# Altium schematic sheet Laser Driver_v6.1.SchDoc
size Tabloid
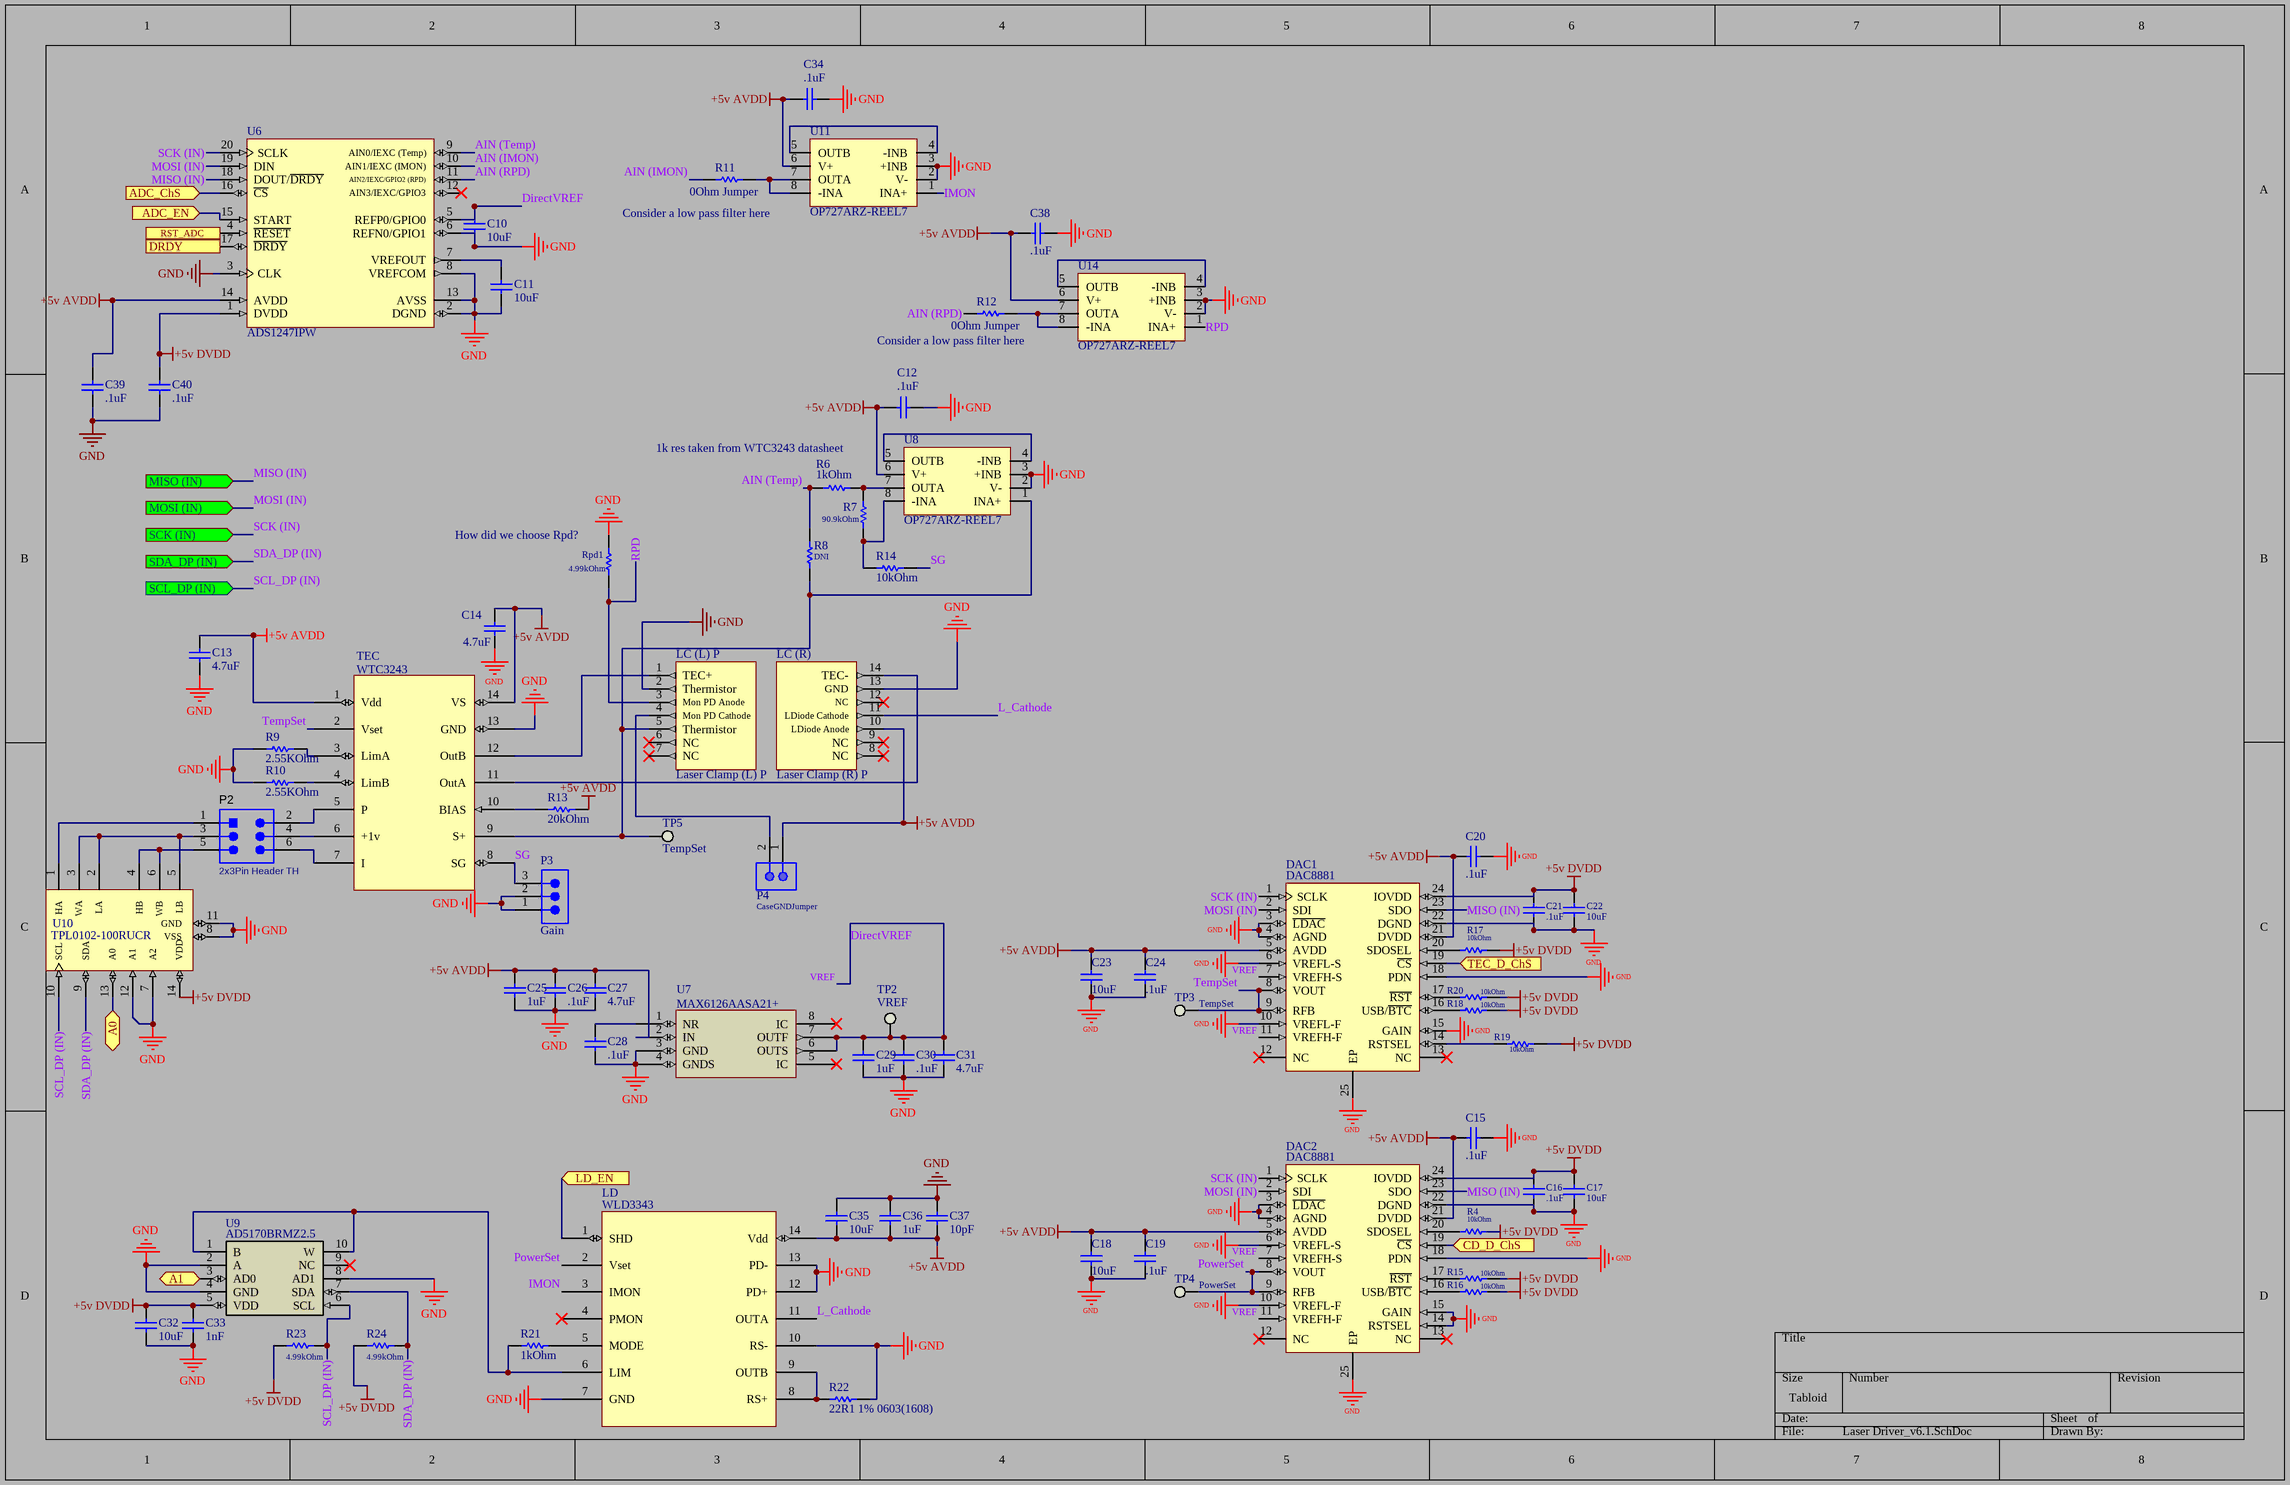
[diagram p0: Laser Driver_v6.1.SchDoc]

## Parts
C10  10uF  [CAPC1608X90X35ML10T15]
C11  10uF  [CAPC1608X90X35ML10T15]
C12  .1uF  [CAPC1608X90X35ML15T15]
C13  4.7uF  [CAPC1608X90X35ML10T15]
C14  4.7uF  [CAPC1608X90X35ML10T15]
C15  .1uF  [CAPC1608X90X35ML15T15]
C16  .1uF  [CAPC1608X90X35ML15T15]
C17  10uF  [CAPC1608X90X35ML10T15]
C18  10uF  [CAPC1608X90X35ML10T15]
C19  .1uF  [CAPC1608X90X35ML15T15]
C20  .1uF  [CAPC1608X90X35ML15T15]
C21  .1uF  [CAPC1608X90X35ML15T15]
C22  10uF  [CAPC1608X90X35ML10T15]
C23  10uF  [CAPC1608X90X35ML10T15]
C24  .1uF  [CAPC1608X90X35ML15T15]
C25  1uF  [CAPC1608X90X35ML15T15]
C26  .1uF  [CAPC1608X90X35ML15T15]
C27  4.7uF  [CAPC1608X90X35ML10T15]
C28  .1uF  [CAPC1608X90X35ML15T15]
C29  1uF  [CAPC1608X90X35ML15T15]
C30  .1uF  [CAPC1608X90X35ML15T15]
C31  4.7uF  [CAPC1608X90X35ML10T15]
C32  10uF  [CAPC1608X90X35ML10T15]
C33  1nF  [CAPC1608X90X35LL15T15]
C34  .1uF  [CAPC1608X90X35ML15T15]
C35  10uF  [CAPC1608X90X35ML10T15]
C36  1uF  [CAPC1608X90X35ML15T15]
C37  10pF  [CAPC1608X90X35LL15T15]
C38  .1uF  [CAPC1608X90X35ML15T15]
C39  .1uF  [CAPC1608X90X35ML15T15]
C40  .1uF  [CAPC1608X90X35ML15T15]
DAC1  DAC8881  [TI-RGE24-2450X2450TP_V]
DAC2  DAC8881  [TI-RGE24-2450X2450TP_V]
LC_(L)_P  Laser Clamp (L) P  [LaserClamp_L_Pump]
LC_(R)  Laser Clamp (R) P  [LaserClamp_R_Pump]
LD  WLD3343  [WLD3343]
P2  2x3Pin Header TH  [SMTC-TSW-103-07-G-D_V]
P3  Gain  [SMTC-TSW-103-07-X-S]
P4  CaseGNDJumper  [SMTC-TSW-102-07-S-S]
R4  10kOhm  [RESC1609X55X30LL15T15]
R6  1kOhm  [RESC1609X50X30LL8T20]
R7  90.9kOhm  [RESC1608X55X30NL15T15]
R8  DNI  [RESC1608X55X25NL10T15]
R9  2.55KOhm  [RESC1608X55X25NL10T15]
R10  2.55KOhm  [RESC1608X55X25NL10T15]
R11  0Ohm Jumper  [RESC1608X55X25NL10T15]
R12  0Ohm Jumper  [RESC1608X55X25NL10T15]
R13  20kOhm  [RESC1608X55X25NL10T15]
R14  10kOhm  [RESC1609X55X30LL15T15]
R15  10kOhm  [RESC1609X55X30LL15T15]
R16  10kOhm  [RESC1609X55X30LL15T15]
R17  10kOhm  [RESC1609X55X30LL15T15]
R18  10kOhm  [RESC1609X55X30LL15T15]
R19  10kOhm  [RESC1609X55X30LL15T15]
R20  10kOhm  [RESC1609X55X30LL15T15]
R21  1kOhm  [RESC1609X50X30LL8T20]
R22  22R1 1% 0603(1608)  [RESC0603(1608)_M]
R23  4.99kOhm  [RESC1608X55X30NL15T15]
R24  4.99kOhm  [RESC1608X55X30NL15T15]
Rpd1  4.99kOhm  [RESC1608X55X30NL15T15]
TEC  WTC3243  [WTC3243]
TP2  VREF  [KSTN-5015_V]
TP3  TempSet  [KSTN-5015_V]
TP4  PowerSet  [KSTN-5015_V]
TP5  TempSet  [KSTN-5015_V]
U6  ADS1247IPW  [TI-PW20_N]
U7  MAX6126AASA21+  [21-0041B_8]
U8  OP727ARZ-REEL7  [ADI-R-8_L]
U9  AD5170BRMZ2.5  [RM_10]
U10  TPL0102-100RUCR  [TI-RUC14_V]
U11  OP727ARZ-REEL7  [ADI-R-8_L]
U14  OP727ARZ-REEL7  [ADI-R-8_L]

## Ports
A0 (bidir), A1 (bidir), ADC_ChS (in), ADC_EN (in), CD_D_ChS (in), DRDY (in), LD_EN (in), MISO (IN) (in), MOSI (IN) (in), RST_ADC (in), SCK (IN) (in), SCL_DP (IN) (in), SDA_DP (IN) (in), TEC_D_ChS (in)

## Nets
+5v AVDD: C12.1 C13.2 C14.2 C15.1 C18.1 C19.1 C20.1 C23.1 C24.1 C25.2 C26.2 C27.2 C34.1 C35.1 C36.2 C37.1 C38.1 C39.2 DAC1.5(AVDD) DAC1.21(DVDD) DAC2.5(AVDD) DAC2.21(DVDD) LC_(R).10(LDiode_Anode) LD.14(Vdd) P4.1 R13.2 TEC.1(Vdd) TEC.14(VS) U6.14(AVDD) U7.2(IN) U8.6(V+) U11.6(V+) U14.6(V+)
+5v DVDD: C16.2 C17.2 C21.2 C22.2 C32.2 C33.2 C40.2 DAC1.24(IOVDD) DAC2.24(IOVDD) R4.2 R15.2 R16.2 R17.2 R18.2 R19.2 R20.2 R23.1 R24.1 U6.1(DVDD) U9.5(VDD) U10.14(VDD)
GND: C10.1 C11.1 C12.2 C13.1 C14.1 C15.2 C16.1 C17.1 C18.2 C19.2 C20.2 C21.1 C22.1 C23.2 C24.2 C25.1 C26.1 C27.1 C28.1 C29.1 C30.1 C31.1 C32.1 C33.1 C34.2 C35.2 C36.1 C37.2 C38.2 C39.1 C40.1 DAC1.3(~{LDAC}) DAC1.4(AGND) DAC1.6(VREFL-S) DAC1.10(VREFL-F) DAC1.15(GAIN) DAC1.18(PDN) DAC1.22(DGND) DAC1.25(EP) DAC2.3(~{LDAC}) DAC2.4(AGND) DAC2.6(VREFL-S) DAC2.10(VREFL-F) DAC2.14(RSTSEL) DAC2.15(GAIN) DAC2.18(PDN) DAC2.22(DGND) DAC2.25(EP) LC_(L)_P.2(Thermistor) LC_(R).13(GND) LD.7(GND) LD.10(RS-) LD.12(PD+) LD.13(PD-) P3.1 P3.2 R9.1 R10.1 R22.2 Rpd1.2 TEC.13(GND) U6.2(DGND) U6.3(CLK) U6.6(REFN0/GPIO1) U6.8(VREFCOM) U6.13(AVSS) U7.3(GND) U7.4(GNDS) U8.2(V-) U8.3(+INB) U9.2(A) U9.4(GND) U9.8(AD1) U10.7(A2) U10.8(VSS) U10.11(GND) U10.12(A1) U11.2(V-) U11.3(+INB) U14.2(V-) U14.3(+INB)
A0: U10.13(A0) ; port A0
A1: U9.3(AD0) ; port A1
ADC_ChS: U6.16(~{CS}) ; port ADC_ChS
ADC_EN: U6.15(START) ; port ADC_EN
AIN (IMON): R11.1 U6.10(AIN1/IEXC_(IMON))
AIN (RPD): R12.1 U6.11(AIN2/IEXC/GPIO2_(RPD))
AIN (Temp): R6.1 R8.2 U6.9(AIN0/IEXC_(Temp))
CD_D_ChS: DAC2.19(~{CS}) ; port CD_D_ChS
DirectVREF: C10.2 C29.2 C30.2 C31.2 DAC1.7(VREFH-S) DAC1.11(VREFH-F) DAC2.7(VREFH-S) DAC2.11(VREFH-F) TP2.1 U6.5(REFP0/GPIO0) U7.6(OUTS) U7.7(OUTF)  [also labelled VREF]
DRDY: U6.17(~{DRDY}) ; port DRDY
IMON: LD.3(IMON) U11.1(INA+)
L_Cathode: LC_(R).11(LDiode_Cathode) LD.11(OUTA)
LD_EN: LD.1(SHD) ; port LD_EN
MISO (IN): DAC1.23(SDO) DAC2.23(SDO) U6.18(DOUT/~{DRDY}) ; port MISO (IN)
MOSI (IN): DAC1.2(SDI) DAC2.2(SDI) U6.19(DIN) ; port MOSI (IN)
PowerSet: DAC2.8(VOUT) DAC2.9(RFB) LD.2(Vset) TP4.1
RPD: LC_(L)_P.3(Mon_PD_Anode) Rpd1.1 U14.1(INA+)
RST_ADC: U6.4(~{RESET}) ; port RST_ADC
SCK (IN): DAC1.1(SCLK) DAC2.1(SCLK) U6.20(SCLK) ; port SCK (IN)
SCL_DP (IN): R23.2 U9.6(SCL) U10.10(SCL) ; port SCL_DP (IN)
SDA_DP (IN): R24.2 U9.7(SDA) U10.9(SDA) ; port SDA_DP (IN)
SG: P3.3 R14.2 TEC.8(SG)
TEC_D_ChS: DAC1.19(~{CS}) ; port TEC_D_ChS
TempSet: DAC1.8(VOUT) DAC1.9(RFB) TEC.2(Vset) TP3.1
NetC11_2: C11.2 U6.7(VREFOUT)
NetC28_2: C28.2 U7.1(NR)
NetDAC1_14: DAC1.14(RSTSEL) R19.1
NetDAC1_16: DAC1.16(USB/~{BTC}) R18.1
NetDAC1_17: DAC1.17(~{RST}) R20.1
NetDAC1_20: DAC1.20(SDOSEL) R17.1
NetDAC2_16: DAC2.16(USB/~{BTC}) R16.1
NetDAC2_17: DAC2.17(~{RST}) R15.1
NetDAC2_20: DAC2.20(SDOSEL) R4.1
NetLC_(L)_P_1: LC_(L)_P.1(TEC+) TEC.12(OutB)
NetLC_(L)_P_4: LC_(L)_P.4(Mon_PD_Cathode) P4.2
NetLC_(L)_P_5: LC_(L)_P.5(Thermistor) R8.1 TEC.9(S+) TP5.1 U8.1(INA+)
NetLC_(R)_14: LC_(R).14(TEC-) TEC.11(OutA)
NetLD_5: LD.5(MODE) R21.2
NetLD_6: LD.6(LIM) R21.1 U9.1(B) U9.10(W)
NetLD_8: LD.8(RS+) LD.9(OUTB) R22.1
NetP2_1: P2.1 U10.1(HA)
NetP2_2: P2.2 TEC.5(P)
NetP2_3: P2.3 U10.2(LA) U10.3(WA) U10.5(LB)
NetP2_4: P2.4 TEC.6(+1v)
NetP2_5: P2.5 U10.4(HB) U10.6(WB)
NetP2_6: P2.6 TEC.7(I)
NetR6_2: R6.2 R7.2 U8.7(OUTA)
NetR7_1: R7.1 R14.1 U8.8(-INA)
NetR9_2: R9.2 TEC.3(LimA)
NetR10_2: R10.2 TEC.4(LimB)
NetR11_2: R11.2 U11.7(OUTA) U11.8(-INA)
NetR12_2: R12.2 U14.7(OUTA) U14.8(-INA)
NetR13_1: R13.1 TEC.10(BIAS)
NetU8_4: U8.4(-INB) U8.5(OUTB)
NetU11_4: U11.4(-INB) U11.5(OUTB)
NetU14_4: U14.4(-INB) U14.5(OUTB)

Not connected (* = marked no-connect by the designer): DAC1 12(NC)* 13(NC)*; DAC2 12(NC)* 13(NC)*; LC_(L)_P 6(NC)* 7(NC)*; LC_(R) 8(NC)* 9(NC)* 12(NC)*; LD 4(PMON)*; U6 12(AIN3/IEXC/GPIO3)*; U7 5(IC)* 8(IC)*; U9 9(NC)*

## Notes on the sheet
- (near U11) Consider a low pass filter here
- Consider a low pass filter here
- 1k res taken from WTC3243 datasheet
- (near Rpd1) How did we choose Rpd?

## Library data of the parts
C10 C11 C17 C18 C22 C23 C32 C35 = CMP-2006-02549-1: Part Number: GRM188R60G106ME47J; Manufacturer: Murata
C12 C15 C16 C19-C21 C24 C26 C28 C30 C34 C38-C40 = CMP-2006-04192-1: Part Number: 06033D104MAT2A; Manufacturer: AVX Interconnect / Elco
C13 C14 C27 C31 = CMP-2006-02799-2: Chip Capacitor, 4.7 uF, +/- 10%, 6.3 V, -55 to 85 degC, 0603 (1608 Metric), RoHS, Tape and Reel; PartNumber: GRM188R60J475KE19D; Voltage Rating (DC): 3 V; Voltage Rating: 6.3 V; Type (Capacitors): X5R; Case/Package: 0603; Case Code (Imperial): 0603; Packaging: Tape and Reel; Mount: Surface Mount; Height: 0.8 mm; REACH SVHC: No SVHC; ComponentLink1URL: http://www.murata.com/; ComponentLink2URL: http://psearch.en.murata.com/capacitor/product/GRM188R60J475KE19%23.pdf; Min Operating Temperature: -55 degC; Max Operating Temperature: 85 degC; Length: 1.6 mm; Case Code (Metric): 1608; Radiation Hardening: No; PackageDescription: 2-Pin Surface Mount Device, Body 1.6 x 0.8 mm; RoHSCompliant: true; Tolerance: 10%; Width: 0.8 mm; ComponentLink1Description: Manufacturer URL; Mounting Technology: Surface Mount; ComponentLink2Description: Datasheet; Capacitance: 4.7 uF; Package Quantity: 4000; DatasheetVersion: 08/2016
C25 C29 C36 = CMP-2006-04474-1: Part Number: 06036D105KAT2A; Manufacturer: AVX Interconnect / Elco
C33 = CMP-2006-04378-1: Manufacturer: AVX Interconnect / Elco; Part Number: 06035C102KAT2A
C37 = CMP-2006-04212-1: Manufacturer: AVX Interconnect / Elco; Part Number: 06035A100DAT2A
DAC1 DAC2 = CMP-0004-01437-1: Single Channel 16-Bit, Low Noise, Voltage Output DAC, -40 to 105 degC, 24-pin QFN (RGE24), Green (RoHS & no Sb/Br); PartNumber: DAC8881SRGET; Manufacturer: Texas Instruments; Resolution(Bits): 16; SubFamily: Precision DAC (=<10MSPS); Power Consumption(Typ)(mW): 6; DAC Channels: 1; Interface: Serial SPI; Settling Time(us): 5; ComponentLink2URL: http://www.ti.com/general/docs/lit/getliterature.tsp?genericPartNumber=DAC8881&fileType=pdf; Mounting Technology: Surface Mount; ComponentLink2Description: Datasheet; PackageDescription: 24-Pin Plastic Flat Pack, Body 4 x 4 mm, Pitch 0.5 mm; DatasheetVersion: SBAS422A; PackageVersion: 4204104/G, 07/2011; INL(Max)(+/-LSB): 1; ComponentLink1URL: http://www.ti.com/; Code_JEDEC: MO-220; ComponentLink3URL: http://www.ti.com/litv/pdf/mpqf124f; ComponentLink1Description: Manufacturer URL; PackageReference: RGE24-2450X2450TP; DNL(Max)(+/-LSB): 1; ComponentLink3Description: Package Specification; Eco-Plan: Green (RoHS & no Sb/Br)
LC_(L)_P = Laser Clamp (L) Pump
LC_(R) = Laser Clamp (R) Pump
LD = WLD3343: Laser Current Driver; ComponentLink1Description: Supplier Link; ComponentLink1URL: https://www.teamwavelength.com/product/wld3343-2-2-a-laser-diode-driver/; ComponentLink2Description: Data Sheet; ComponentLink2URL: https://www.teamwavelength.com/product/wld3343-2-2-a-laser-diode-driver/
P2 = CMP-2000-07329-1: Through Hole Header, Pitch 2.54 mm, 2 x 3 Position, Height 8.58 mm, Tail Length 2.54 mm, -55 to 125 degC, RoHS, Bulk; Manufacturer: Samtec-Inc.; Number of Positions Loaded: All; Number of Positions: 6; Row Spacing: 0.100"(2.54mm); Connector Type: Header,Unshrouded; Package Reference: TSW-103-07-G-D; Termination: Solder; Manufacturer URL: http://www.samtec.com/; Contact Finish: Gold; Contact Mating Length: 0.230"(5.84mm); Package Description: Through Hole Header, Pitch 2.54 mm, 2 x 3 Position, Height 8.58 mm, Tail Length 2.54 mm; Datasheet Version: 12/2015; Number of Rows: 2; Features: -; Family: RectangularConnectors-Headers,MalePins; Fastening Type: -; Datasheet URL: http://suddendocs.samtec.com/catalog_english/tsw_th.pdf; Category: Connectors,Interconnects; Package URL: http://suddendocs.samtec.com/prints/tsw-xxx-xx-xxx-x-xx-xxx-mkt.pdf; Mounting Type: ThroughHole; Contact Finish Thickness: 10µin(0.25µm); Packaging: Bulk; Color: Black; Pitch: 0.100"(2.54mm); Series: TSW; Contact Type: MalePin; Mounting Technology: ThroughHole
P3 = CMP-1024-00331-1: 0.025" SQ Post Header, Through-hole, Vertical, -55 to 125 degC, 2.54 mm Pitch, 3-Pin, Male, RoHS; Manufacturer: Samtec; PartNumber: TSW-103-07-F-S; Pitch: 2.54 mm; DatasheetVersion: F-214; ComponentLink1Description: Manufacturer URL; ComponentLink3URL: http://www.samtec.com/documents/webfiles/cpdf/TSW-XXX-XX-XXX-X-XX-XXX-MKT.pdf; Mounting Technology: Through-hole; PackageDescription: .025[0.64] SQ. Post Terminal Strip Assembly; Temperature Range: -55 to 125 degC; ComponentLink3Description: Package Specification; Orientation: Vertical; RoHS: True; PackageVersion: DM, 8/1988; ComponentLink2Description: Datasheet; ComponentLink1URL: http://www.samtec.com; ComponentLink2URL: http://www.samtec.com/documents/webfiles/pdf/TSW_TH.PDF; PackageReference: TSW-103-07-X-S
P4 = CMP-1681-00004-4: Male Header, Pitch 2.54 mm, 1 x 2 Position, Height 8.38 mm, Tail Length 2.54 mm, -55 to 125 degC, RoHS, Bulk; Manufacturer: Samtec; Rows: 1; ComponentLink1URL: http://www.samtec.com/; Contact Finish: Gold; Mounting Technology: Through Hole; PackageReference: TSW-102-07-S-S; RoHSCompliant: true; Pins: 2; Contact Material: Bronze; ComponentLink2Description: Datasheet; Max Operating Temperature: 125 degC; Min Operating Temperature: -55 degC; Height: 8.38 mm; Packaging: Bulk; ComponentLink1Description: Manufacturer URL; PackageDescription: Male Header, Pitch 2.54 mm, 1 x 2 Position, Height 8.38 mm, Tail Length 2.54 mm; Colour: Black; Contact Plating: Gold; Length: 5.08 mm; ComponentLink2URL: http://suddendocs.samtec.com/catalog_english/tsw_th.pdf; DatasheetVersion: 12/2015; Mount: Through Hole; Lead Pitch: 0.1 inch; REACH SVHC: No SVHC; Package Quantity: 1
R4 R14-R20 = CMP-2000-07452-1: Chip Resistor, 10 KOhm, +/- 1%, 0.1 W, -55 to 155 degC, 0603 (1608 Metric), RoHS, Tape and Reel; Manufacturer: Panasonic; Voltage Rating: 75V; Case\/Package: 0603; Power Rating: 100mW; Temperature Coefficient: 100ppm\/degreesC; Number of Pins: 2; Package Reference: 603; Depth: 0.8mm; Mount: SurfaceMount; Package Description: 2-Pin Surface Mount Device, Body 1.6 x 0.85 mm; Datasheet Version: 02/2017; Resistance: 10KOhm; Length: 1.6mm; Lead Free: LeadFree; Height: 0.45mm; Number of Terminations: 2; Max Power Dissipation: 100mW; Min Operating Temperature: -55degC; Datasheet URL: https://industrial.panasonic.com/cdbs/www-data/pdf/RDA0000/AOA0000C304.pdf; Termination: SMD/SMT; Case Code (Metric): 1608; Case Code (Imperial): 0603; Tolerance: 1%; Max Operating Temperature: 155degC; RoHSCompliant: true; Voltage Rating (DC): 75V; Radiation Hardening: No; Packaging: TapeandReel; Composition: ThickFilm; Mounting Technology: SurfaceMount; Manufacturer URL: http://www.panasonic.com/; Width: 0.031inch; REACH SVHC: NoSVHC; Contact Plating: Tin; Military Standard: Not; Package Quantity: 1
R6 R21 = CMP-1666-00003-4: Chip Resistor, 1 KOhm, +/- 1%, 0.1 W, -55 to 155 degC, 0603 (1608 Metric), RoHS, Tape and Reel; Manufacturer: Vishay Semiconductor; DatasheetVersion: 06/2012; ComponentLink1URL: http://www.vishay.com/; ComponentLink2Description: Datasheet; PackageDescription: 2-Pin Surface Mount Device, Body 1.575 x 0.85 mm; Mounting Technology: Surface Mount; ComponentLink1Description: Manufacturer URL; ComponentLink2URL: http://www.vishay.com/docs/20035/dcrcwe3.pdf; PackageReference: 0603
R7 = CMP-2000-00680-1: Manufacturer: Panasonic; Part Number: ERJ-3EKF9092V
R8 R11 R12 = CMP-2100-03667-1: Chip Resistor, 0 Ohm, +/- 5%, 0.1 W, -55 to 155 degC, 0603 (1608 Metric), RoHS, Tape and Reel; Manufacturer: Yageo; Temperature Coefficient: 200ppm/degreesC; Voltage Rating: 50V; Power Rating: 100mW; Resistance: 0mOhm; Width: 0.8mm; Max Operating Temperature: 155degC; Tolerance: 5%; Package Reference: 0603; Height: 0.45mm; Depth: 0.8mm; Package Description: 2-Pin Surface Mount Device, Body 1.6 x 0.8 mm; Termination: SMD/SMT; Package Quantity: 5000; Case/Package: 0603; Case Code (Imperial): 0603; Radiation Hardening: No; Number of Pins: 2; Length: 1.6mm; Lead Free: LeadFree; Voltage Rating (DC): 50V; Military Standard: Not; Datasheet URL: http://www.yageo.com/NewPortal/yageodocoutput?fileName=/pdf/R-Chip/PYu-RC_Group_51_RoHS_L_5.pdf; Manufacturer URL: http://www.yageo.com/; Packaging: TapeandReel; Case Code (Metric): 1608; Min Operating Temperature: -55degC; Composition: ThickFilm; RoHSCompliant: true; Contact Plating: Tin; Datasheet Version: Rev. 5, 10/2016; REACH SVHC: NoSVHC
R9 R10 = CMP-2000-03984-1: Manufacturer: Yageo; Part Number: RC0603FR-072K55L
R13 = CMP-2000-06932-1: Chip Resistor, 20 KOhm, +/- 1%, 0.1 W, -55 to 155 degC, 0603 (1608 Metric), RoHS, Tape and Reel; Manufacturer: Yageo; Power Rating: 100mW; Temperature Coefficient: 100PPM/C; Resistance: 20kOhms; Voltage Rating: 50V; Case Code - in: 0603; Packaging: Reel; Datasheet Version: Rev. 7, 05/2017; Series: RC; Mounting Technology: SurfaceMount; Product: ThickFilmResistorsGeneralPurpose; Manufacturer URL: http://www.yageo.com/; Package Description: 2-Pin Surface Mount Device, Body 1.6 x 0.8 mm; Package Reference: 0603; Termination Style: SMD/SMT; Case Code - mm: 1608; Operating Temperature Range: -55Cto+155C; Datasheet URL: http://www.yageo.com/documents/recent/PYu-RC_Group_51_RoHS_L_7.pdf; Tolerance: 1%
R22 = CMP-1012-00321-1: 22R1 0.1W 1% 0603 (1608 Metric)  SMD; Case-Metric: 1608; Value: 22.10 Ohm; Case-EIA: 0603; Tolerance: 1 %; Power: 0.1 W; Technology: SMT
R23 R24 Rpd1 = CMP-2000-00535-1: Part Number: ERJ-3EKF4991V; Manufacturer: Panasonic
TEC = WTC3243: TEC; ComponentLink1Description: Distributor; ComponentLink1URL: https://www.teamwavelength.com/product/wld3343-2-2-a-laser-diode-driver/; ComponentLink2Description: Data Sheet; ComponentLink2URL: https://www.teamwavelength.com/download/Datasheets/WLD3343.pdf
TP2-TP5 = CMP-2000-05183-1: Test Point, White, SMT; Manufacturer: Keystone; Primary Type: PCBTestPoints; Style: Miniature; Finish Plating: SilverPlate; Material, Contact: PhosphorBronze; Material: PhosphorBronze; Datasheet URL: https://datasheet.ciiva.com/1123/5015-1123862.pdf; Thickness: 0.010In.; Manufacturer URL: http://www.keyelco.com/; Length: 0.105"(2.667mm); Datasheet Version: Mar-14; Contact Plating: Silver; Mounting Type: SurfaceMount; Termination: SMT; Type: TestPointsonTapeandReel; Height: 0.06In.; Mounting: SurfaceMount
U6 = CMP-0003-00815-2: Low Noise, Precision 24-Bit ADC, -40 to 105 degC, 20-pin SOP (PW20), Green (RoHS & no Sb/Br); Manufacturer: Texas Instruments; Analog Voltage AV/DD(Min)(V): 2.7; Analog Voltage AV/DD(Max)(V): 5.25; Resolution(Bits): 24; Architecture: Delta-Sigma; SubFamily: Precision ADC (<=10MSPS); Interface: Serial SPI; # Input Channels: 3; Sample Rate (max)(SPS): 2k; ComponentLink3Description: Package Specification; ComponentLink2Description: Datasheet; ComponentLink1Description: Manufacturer URL; DatasheetVersion: SBAS426G; Mounting Technology: Surface Mount; ComponentLink2URL: http://www.ti.com/general/docs/lit/getliterature.tsp?genericPartNumber=ADS1247&fileType=pdf; PackageVersion: 4040064-5/G, 02/2011; Code_JEDEC: MO-153; PackageReference: PW20; ComponentLink3URL: http://www.ti.com.cn/cn/lit/ml/mpds362/mpds362.pdf; PartNumber: ADS1247IPW; Digital Supply(Max)(V): 5.25; ComponentLink1URL: http://www.ti.com/; PackageDescription: 20-Pin Plastic Small Outline, Body 6.5 x 4.4 mm, Pitch 0.65 mm; Eco-Plan: Green (RoHS & no Sb/Br); Digital Supply(Min)(V): 2.7
U7 = MAX6126AASA21+: No Description Available; Vendor: Maxim Integrated Products; Built_By: EMA_UL_Team; Manufacturer_Part_Number: MAX6126AASA21+; Copyright: Copyright (C) 2018 Accelerated Designs. All rights reserved; RefDes: RefDes; Type: DEV; Value: Value; ComponentLink1Description: DataSheet; ComponentLink1URL: https://datasheets.maximintegrated.com/en/ds/MAX6126.pdf
U8 U11 U14 = CMP-0384-00653-1: Double Channel Rail-to-Rail Operational Amplifier, 700 KHz BW, 200 mV/us SR, Industrial, 8-pin SOIC (R-8), Reel; Manufacturer: Analog Devices; Generic Part Number: OP727; Amplifiers Per Package: 2; Iq/Amp: 290uA; Input Offset Voltage: 30uV; V Span Max: 36V; Small Signal Bandwidth: 700KHz; V Span Min: 3V; Input Bias Current: 5.5nA; PackageDescription: 8-Pin Standard Small Outline Package, Body 3.9 x 4.9 mm, Pitch 1.27 mm; ComponentLink3URL: http://www.analog.com/static/imported-files/packages/PKG_PDF/SOIC_Narrow%20(R)/R_8.pdf; ComponentLink2Description: Datasheet; ComponentLink2URL: http://www.analog.com/static/imported-files/data_sheets/OP777_727_747.pdf; PartNumber: OP727ARZ-REEL7; ComponentLink3Description: Package Specification; Mounting Technology: Surface Mount; PackageVersion: 060506-A; Code_JEDEC: MS-012-AA; DatasheetVersion: Rev. D; Slew Rate: 200mV/us; PackageReference: R-8; ComponentLink1URL: http://www.analog.com/en/index.html; ComponentLink1Description: Manufacturer URL
U9 = AD5170BRMZ2.5: No Description Available; Vendor: Analog Devices Inc; Built_By: EMA_Christopher; Manufacturer_Part_Number: AD5170BRMZ2.5; Copyright: Copyright (C) 2016 Accelerated Designs. All rights reserved; RefDes: RefDes; Type: DEV; Value: Value; ComponentLink1Description: DataSheet; ComponentLink1URL: https://www.analog.com/media/en/technical-documentation/data-sheets/AD5170.pdf
U10 = CMP-0004-01517-1: 256 Tap Dual Channel Digital Potentiometer with I2C Interface and Non-Volatile Memory, -40 to 85 degC, 14-pin QFN (RUC14), Green (RoHS & no Sb/Br); Manufacturer: Texas Instruments; DNL(Max)(+/-LSB): 0.25; INL(Max)(+/-LSB): 0.5; DAC Channels: 2; ComponentLink3URL: http://www.ti.com/lit/ml/mpqf212b/mpqf212b.pdf; DatasheetVersion: SLIS134B; Mounting Technology: Surface Mount; Code_JEDEC: MO-288; Eco-Plan: Green (RoHS & no Sb/Br); SubFamily: Digital Potentiometer; ComponentLink2Description: Datasheet; PackageReference: RUC14; PackageVersion: 4208447/C, 08/2008; PackageDescription: 14-Pin Plastic Quad Flatpack No-Lead, Body 2 x 2 mm, Pitch 0.4 mm; ComponentLink2URL: http://www.ti.com/general/docs/lit/getliterature.tsp?genericPartNumber=TPL0102-100&fileType=pdf; ComponentLink1URL: http://www.ti.com/; ComponentLink1Description: Manufacturer URL; Interface: I2C; PartNumber: TPL0102-100RUCR; ComponentLink3Description: Package Specification